# EAGLE design clock (EAGLE 8.6.0)
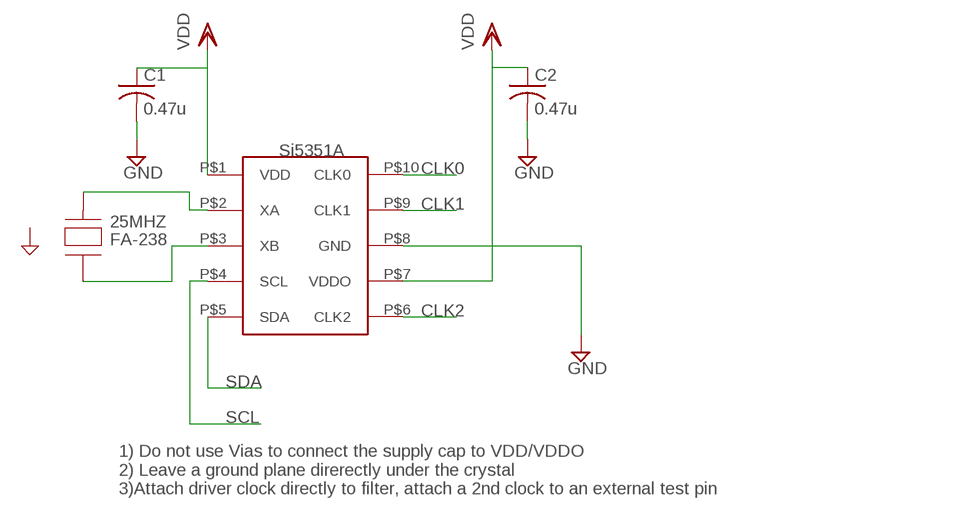
[diagram p0: schematic, sheet 1]

## Parts
25MHZ  FA-238  [FA-238]
C1  0.47u  C-USC0805  [C0805]
C2  0.47u  C-USC0805  [C0805]
U$2  SI5351A  [MSOP-10]

## Nets
CLK0: U$2.P$10(CLK0)
CLK1: U$2.P$9(CLK1)
CLK2: U$2.P$6(CLK2)
GND: C1.2 C2.2 U$2.P$8(GND)
N$27: 25MHZ.P$4(XA) U$2.P$2(XA)
N$28: 25MHZ.P$2(XB) U$2.P$3(XB)
SCL: U$2.P$4(SCL)
SDA: U$2.P$5(SDA)
VDD: C1.1 C2.1 U$2.P$1(VDD) U$2.P$7(VDDO)
Unconnected: 25MHZ.P$1(GND) 25MHZ.P$3(GND)

## Notes on the sheet
- 1) Do not use Vias to connect the supply cap to VDD/VDDO
  2) Leave a ground plane direrectly under the crystal
  3)Attach driver clock directly to filter, attach a 2nd clock to an external test pin

## Library data of the parts
25MHZ = ARVP:FA-238
C1 C2 = rcl:C-US: CAPACITOR, American symbol; SPICEPREFIX: C
U$2 = ARVP:SI5351A

## Board
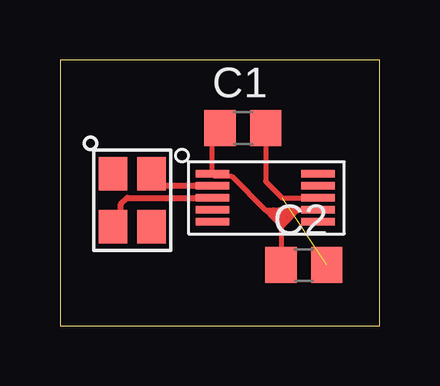
[diagram p1: board, top side]

Size 13.31 x 11.1 mm. Coordinates in mm from the lower left corner, seen from the top.
Outline: 0,0 13.31,0 13.31,11.1 0,11.1 0,0
Copper layers (1*16): Top 0.035mm / dielectric 1.5mm / Bottom 0.035mm
Design rules "default": minimum track width 6mil, minimum drill 0.35mm, track to track 6mil, track to pad 6mil, pad to pad 6mil, via to via 6mil, smd to smd 6mil, copper to edge 40mil, drill to drill 6mil, minimum pad ring 10mil, minimum via ring 8mil, stop-mask expansion 4mil, vias tented up to drill 0mil, thermal gap 10mil

### Footprints (pad centres in the part's own frame; a part is rotated, then mirrored left to right if it is on the bottom)
FA-238 = smd 1.4 x 1.2: P$1 0,-1.6; P$2 2.2,-1.6; P$3 2.2,0; P$4 0,0
C0805 = smd 1.3 x 1.5: 1 -0.95,0; 2 0.95,0
MSOP-10 = smd 1.4 x 0.3: P$1 0,0; P$2 0,-0.5; P$3 0,-1; P$4 0,-1.5; P$5 0,-2; P$6 4.4,-2; P$7 4.4,-1.5; P$8 4.4,-1; P$9 4.4,-0.5; P$10 4.4,0

### Placement (x,y rotation side)
25MHZ  3.81,6.35 270 top
C1  7.62,8.26 0 top
C2  10.16,2.54 0 top
U$2  6.35,6.35 0 top

### Tracks (layer width: path | path; a pad name or v marks a point on that pad's centre or on a via)
GND  (1 unrouted)
  Top 0.203: C1.2 8.57,6.04 9.26,5.35 U$2.P$8
N$27
  Top 0.254: U$2.P$2 4.31,5.85 25MHZ.P$4
N$28
  Top 0.254: 25MHZ.P$2 2.54,4.48 2.54,5.08 2.81,5.35 U$2.P$3
VDD
  Top 0.203: C1.1 6.35,7.93 U$2.P$1 6.45,6.25 7.16,6.25 8.56,4.85 | U$2.P$7 9.93,4.85 | 9.21,4.13 C2.1 | 9.73,4.65 9.53,4.45 | 9.53,4.45 9.21,4.13 | 8.56,4.85 8.89,4.85 | 8.89,4.85 9.12,4.85 | 9.12,4.85 9.53,4.85 | 9.53,4.85 9.93,4.85 | 9.21,4.2 9.21,4.45 | 9.21,4.53 9.21,4.54 | 9.21,4.54 9.32,4.65 | 9.32,4.65 9.53,4.85 | 9.93,4.85 9.73,4.65 | 9.73,4.65 9.41,4.65 | 9.41,4.65 9.32,4.65 | 9.21,4.45 9.41,4.65 | 9.21,4.45 9.53,4.45 | 9.12,4.85 9.21,4.76 | 9.21,4.76 9.32,4.65 | 9.21,4.54 9.21,4.76 | 9.21,4.13 9.21,4.2 | 9.21,4.2 8.93,4.48 | 8.93,4.48 8.76,4.65 | 8.89,4.85 9.09,4.65 | 9.09,4.65 9.21,4.53 | 9.21,4.53 9.21,4.45 | 8.93,4.48 9.16,4.48 9.21,4.53 | 8.93,4.48 9.09,4.65 | 9.09,4.65 8.76,4.65 | 8.76,4.65 8.56,4.85